# EAGLE board INV_H (EAGLE 9.6.2), part 1 of 2
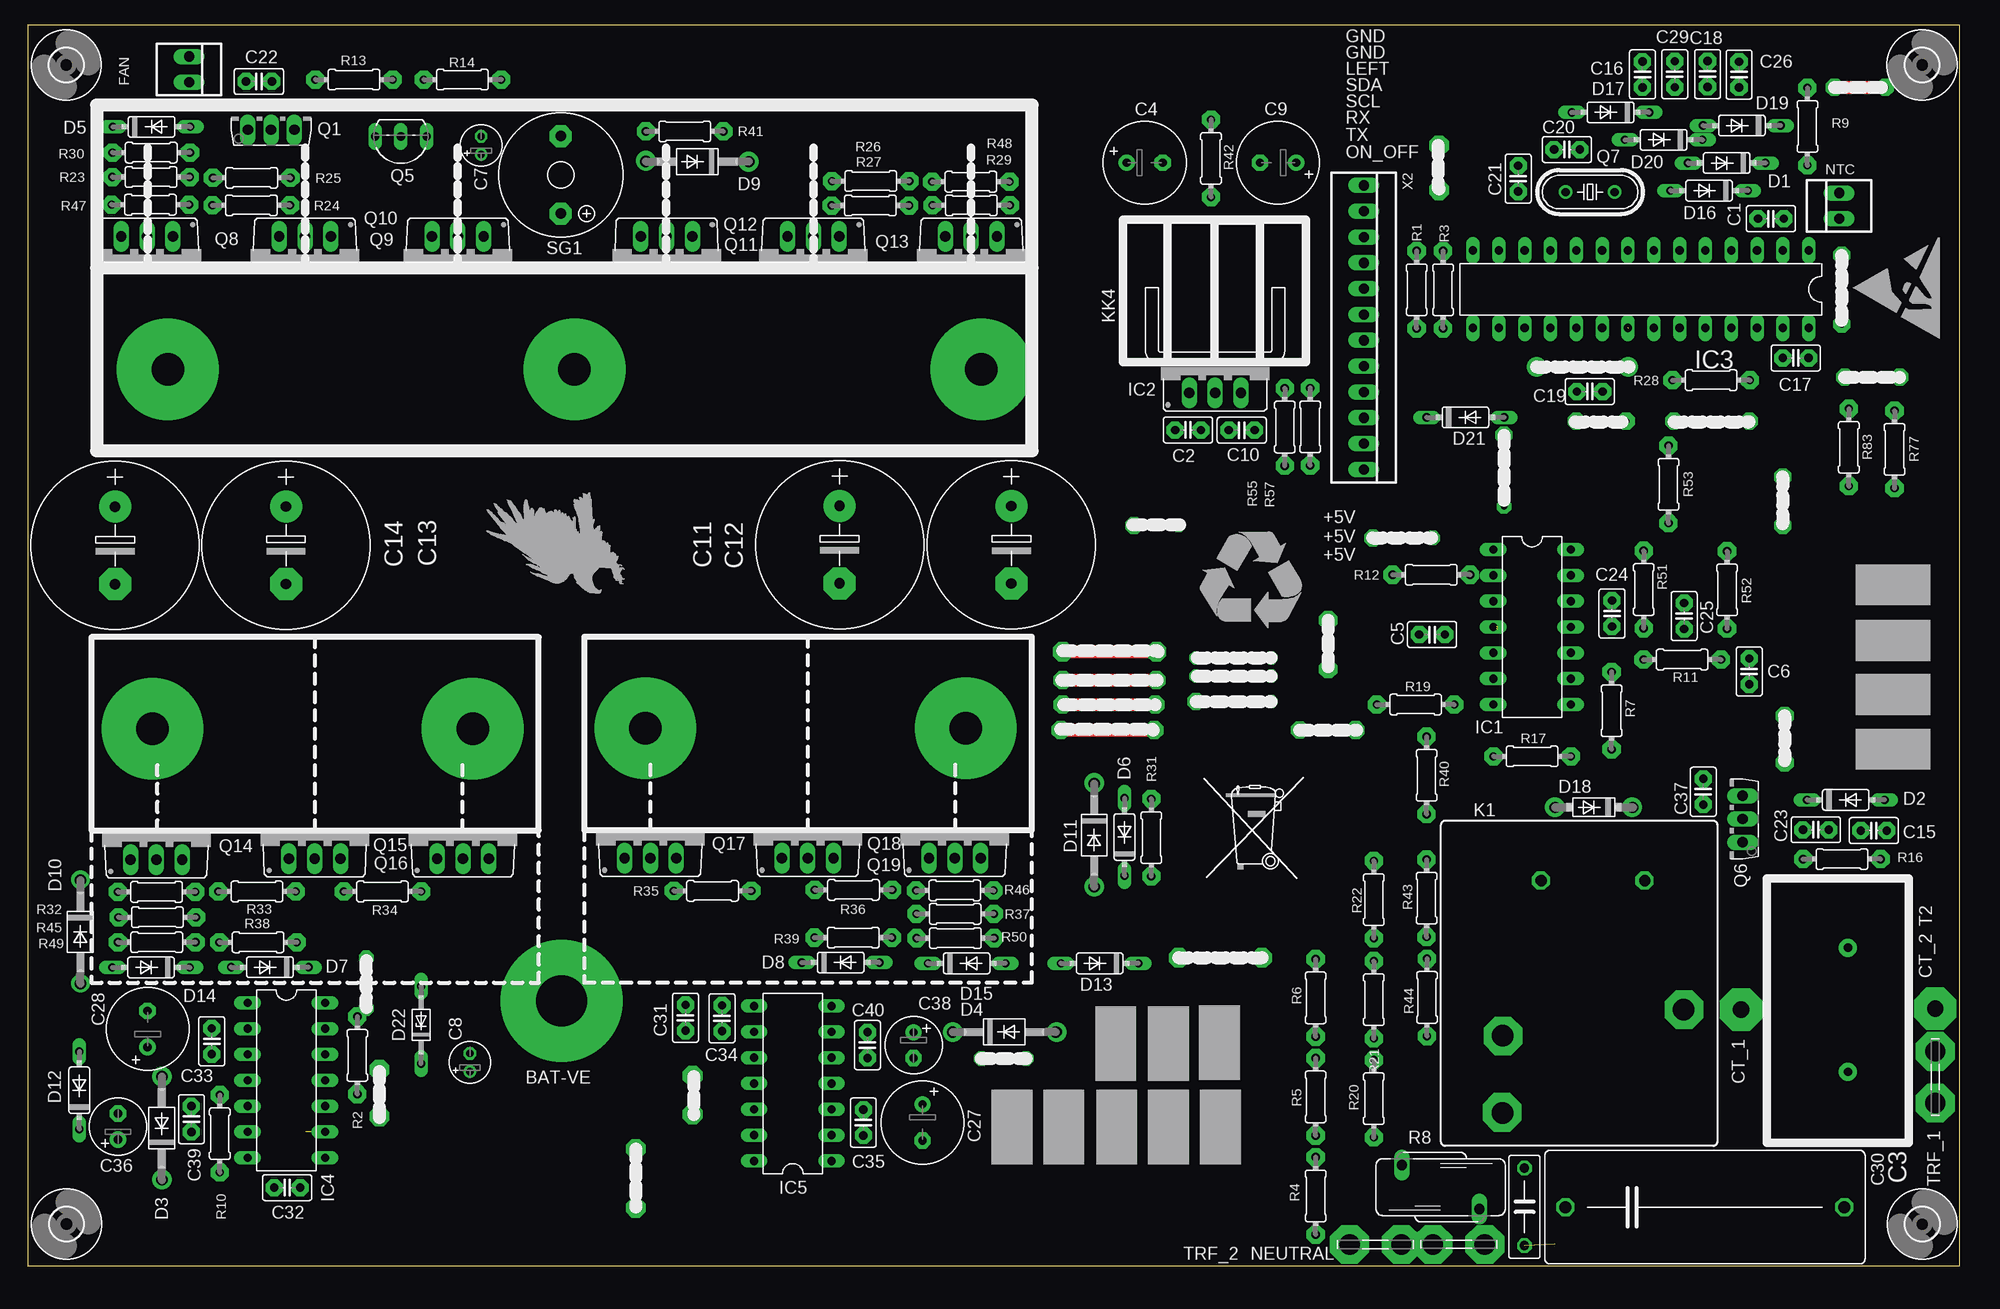
[diagram p1: board, top side]
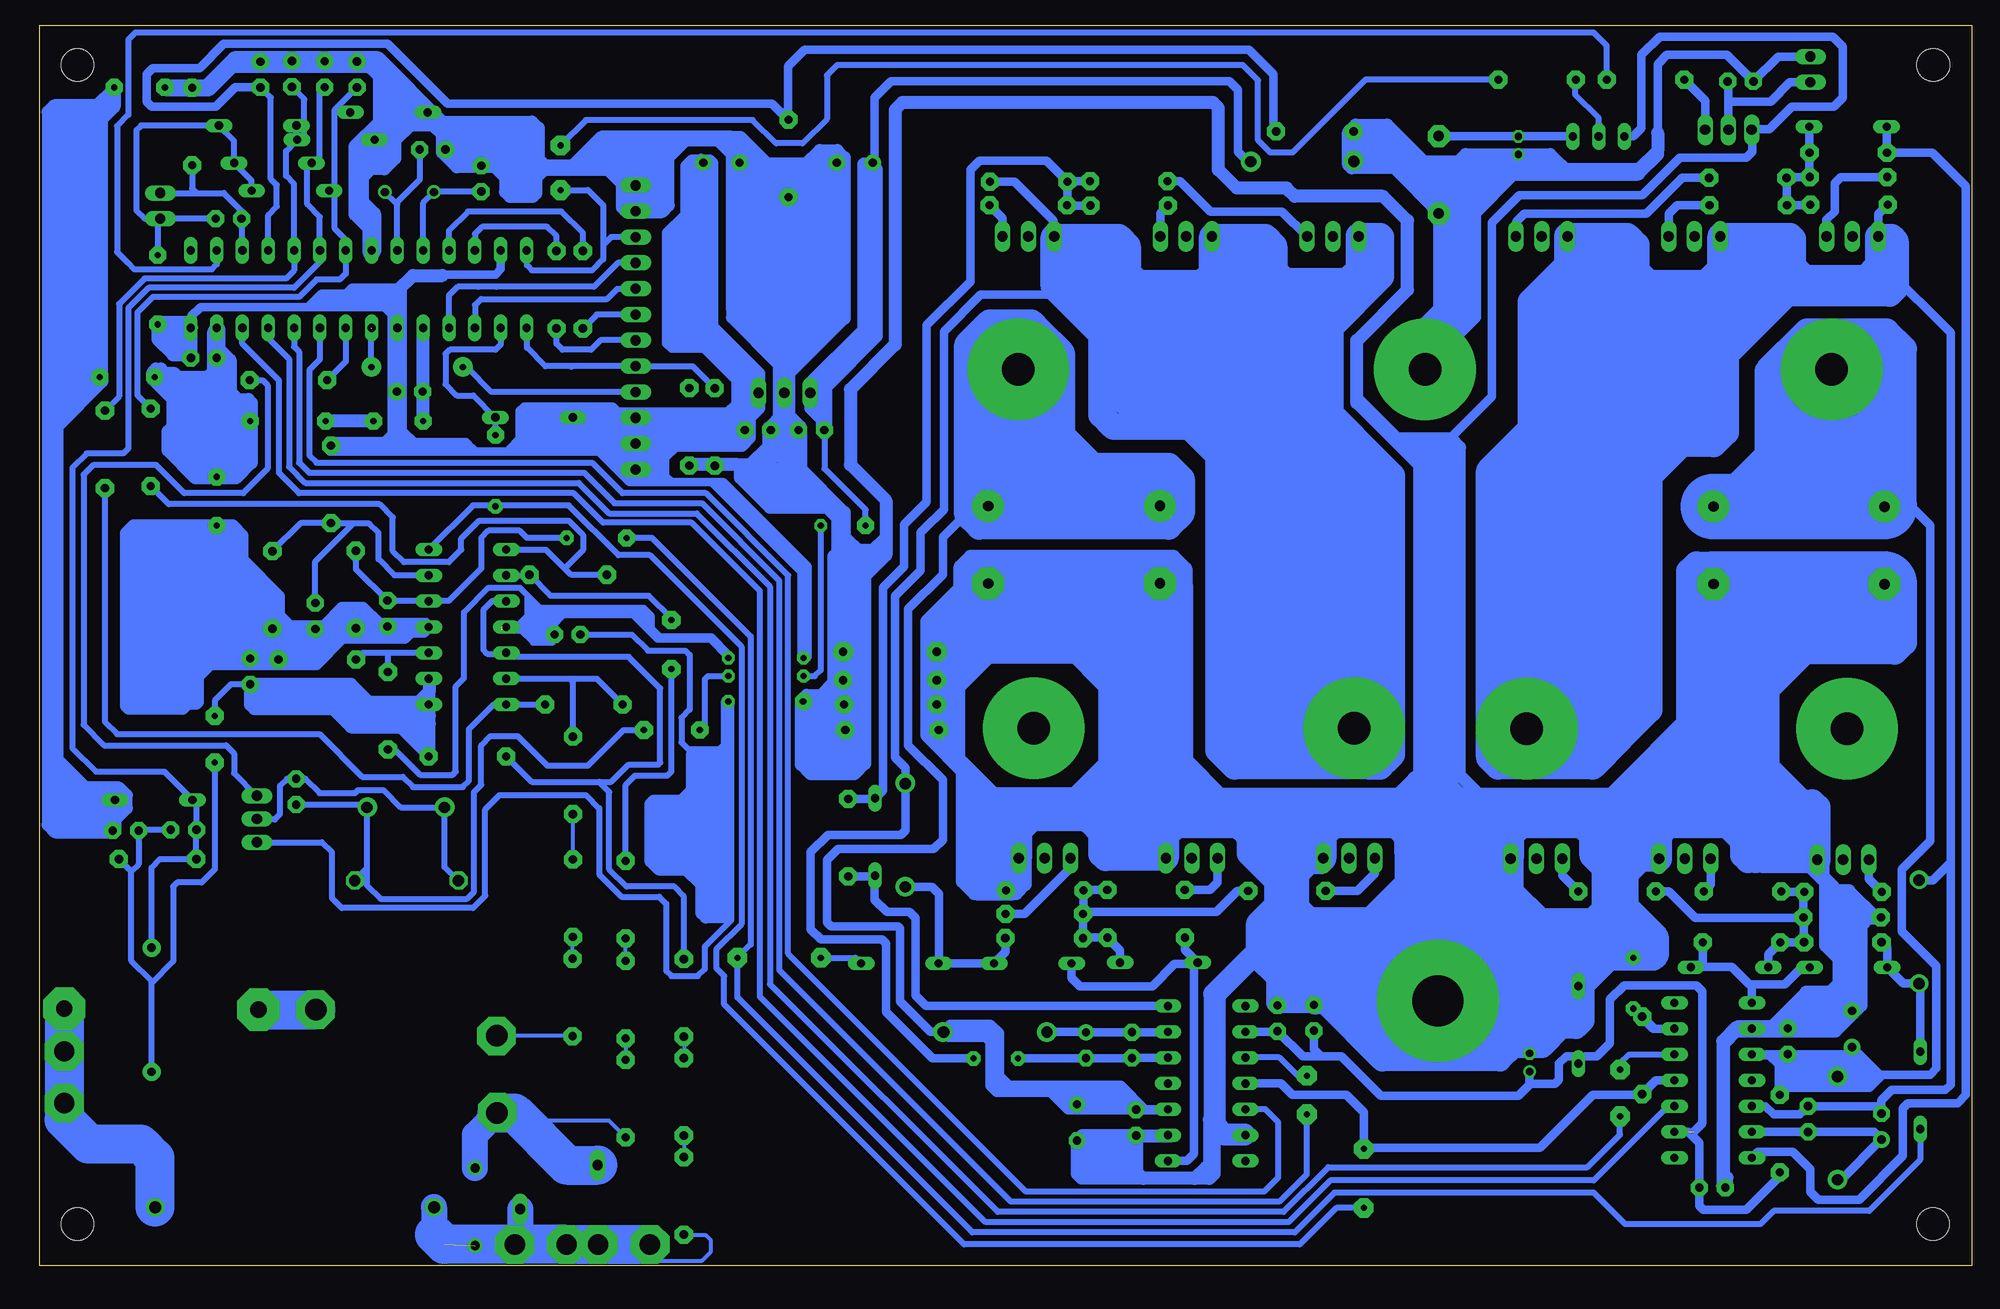
[diagram p2: board, bottom side, seen from below]

Size 190 x 122 mm. Coordinates in mm from the lower left corner, seen from the top.
Outline: 0,0 190,0 190,122 0,122 0,0
Copper layers (1*16): Top 0.035mm / dielectric 1.5mm / Bottom 0.035mm
Design rules "default": minimum track width 10mil, minimum drill 24mil, track to track 8mil, track to pad 8mil, pad to pad 8mil, via to via 8mil, smd to smd 8mil, copper to edge 40mil, drill to drill 8mil, minimum pad ring 10mil, minimum via ring 8mil, stop-mask expansion 4mil, vias tented up to drill 0mil, thermal gap 10mil

## Footprints (pad centres in the part's own frame; a part is rotated, then mirrored left to right if it is on the bottom)
8/5 = drill 5 pad 12: P$1 0,0
C025-025X050 = drill 0.813 octagon: 1 -1.27,0; 2 1.27,0 | drill 0.8 pad 1.676 octagon: 3 -1.27,0; 4 1.27,0
C275-113X316 = drill 1.194 octagon: 1 -13.716,0; 2 13.716,0
E3,5-8 = drill 0.813 pad 1.6: + -1.778,0 | drill 0.813 pad 1.6 octagon: - 1.778,0
E1,8-4 = drill 0.711 pad 1.168: + -0.889,0 | drill 0.711 pad 1.168 octagon: - 0.889,0
E7,5-16 = drill 1.016 pad 3.15: + -3.81,0 | drill 1.016 pad 3.15 octagon: - 3.81,0
C075-032X103 = drill 0.914 octagon: 1 -3.81,0; 2 3.81,0
E2,5-6 = drill 0.813 pad 1.6: + -1.27,0 | drill 0.813 pad 1.6 octagon: - 1.27,0
4,16O1,6 = drill 1.6 pad 4.166 octagon: 1 0,0
DO35-7 = drill 0.813 long: A 3.81,0; C -3.81,0
DO41-10 = drill 1.118: A 5.08,0; C -5.08,0
DO41-7.6 = drill 1.1 pad 1.7: A 3.81,0; C -3.81,0
DO34Z7 = drill 0.813 long: A 3.81,0; C -3.81,0
22-23-2021 = drill 1 long: 1 -1.27,0; 2 1.27,0
3,2 = hole 3.2: 0,0
DIL14 = drill 0.813 long: 1 -7.62,-3.81; 2 -5.08,-3.81; 3 -2.54,-3.81; 4 0,-3.81; 5 2.54,-3.81; 6 5.08,-3.81; 7 7.62,-3.81; 8 7.62,3.81; 9 5.08,3.81; 10 2.54,3.81; 11 0,3.81; 12 -2.54,3.81; 13 -5.08,3.81; 14 -7.62,3.81
78XXS = drill 1.016 long: GND 0,-2.54; IN -2.54,-2.54; OUT 2.54,-2.54
DIL28-3 = drill 0.813 long: 1 -16.51,-3.81; 2 -13.97,-3.81; 3 -11.43,-3.81; 4 -8.89,-3.81; 5 -6.35,-3.81; 6 -3.81,-3.81; 7 -1.27,-3.81; 8 1.27,-3.81; 9 3.81,-3.81; 10 6.35,-3.81; 11 8.89,-3.81; 12 11.43,-3.81; 13 13.97,-3.81; 14 16.51,-3.81; 15 16.51,3.81; 16 13.97,3.81; 17 11.43,3.81; 18 8.89,3.81; 19 6.35,3.81; 20 3.81,3.81; 21 1.27,3.81; 22 -1.27,3.81; 23 -3.81,3.81; 24 -6.35,3.81; 25 -8.89,3.81; 26 -11.43,3.81; 27 -13.97,3.81; 28 -16.51,3.81
JT-TMB = drill 1.1: 1 5.08,0; 2 -5.08,0 | drill 2.1: C -8.89,12.7; NC 8.89,22.86; NO 8.89,15.24
800W_BIG = drill 3.2 pad 10: P$1 7,8; P$2 47,8; P$3 87,8
TE_62409-1 = drill 1.43: 1 -2.54,0; 2 2.54,0
TO126AV = drill 1.016 long: B 2.286,-1.27; C 0,-1.27; E -2.286,-1.27
TO92-EBC = drill 0.813 long: B 0,-1.27; C -2.54,-1.27; E 2.54,-1.27
HC49/S = drill 0.813: 1 -2.413,0; 2 2.413,0
TO220BV = drill 1.016 long: D 0,-2.54; G -2.54,-2.54; S 2.54,-2.54
0204/7 = drill 0.8 pad 1.778 octagon: 1 -3.81,0; 2 3.81,0 | drill 0.813 octagon: 3 -3.81,0; 4 3.81,0
S10K385 = drill 1.016 long: 1 -2.159,-3.81; 2 2.159,3.81
F/TMB = drill 1.016 pad 2.159 octagon: + 3.81,0; - -3.81,0
CT_5A = drill 0.8 pad 1.778: P$1 0,0; P$2 12.2,0
800W_SMALL = drill 3 pad 6: P$1 6,10; P$2 37.5,10 | drill 3.2 pad 10: P$3 6,10; P$4 37.5,10
22-23-2121 = drill 1 long: 1 -13.97,0; 2 -11.43,0; 3 -8.89,0; 4 -6.35,0; 5 -3.81,0; 6 -1.27,0; 7 1.27,0; 8 3.81,0; 9 6.35,0; 10 8.89,0; 11 11.43,0; 12 13.97,0

## Placement (x,y rotation side)
BAT-VE  12/5  [8/5]  52.5,26.06 180 top
C1  0.1uF 50V  [C025-025X050]  171.44,102.99 0 top
C2  0.1uF 50V  [C025-025X050]  114.12,82.21 180 top
C3  1.5uF 305VAC  [C275-113X316]  164.95,5.77 0 top
C4  470uF 25V  [E3,5-8]  109.86,108.51 0 top
C5  0.1uF 50V  [C025-025X050]  138.12,62.09 0 top
C6  0.1uF 50V  [C025-025X050]  169.31,58.46 90 top
C7  1uF 16V  [E1,8-4]  44.6,110.2 90 top
C8  1uF 16V  [E1,8-4]  43.5,20 90 top
C9  470uF 25V  [E3,5-8]  122.97,108.49 180 top
C10  0.1uF 50V  [C025-025X050]  119.4,82.19 0 top
C11  2200uF 50V  [E7,5-16]  79.85,70.93 270 top
C12  2200uF 50V  [E7,5-16]  96.75,70.92 270 top
C13  2200uF 50V  [E7,5-16]  25.41,70.87 270 top
C14  2200uF 50V  [E7,5-16]  8.61,70.86 270 top
C15  0.1uF 50V  [C025-025X050]  181.56,42.81 180 top
C16  0.01uF 50V  [C025-025X050]  158.81,117.18 90 top
C17  0.1uF 50V  [C025-025X050]  173.88,89.29 0 top
C18  0.01uF 50V  [C025-025X050]  165.21,117.22 90 top
C19  0.1uF 50V  [C025-025X050]  153.62,85.99 0 top
C20  18pF 50V  [C025-025X050]  151.38,109.79 180 top
C21  18pF 50V  [C025-025X050]  146.59,106.93 90 top
C22  0.1uF 50V  [C025-025X050]  22.75,116.49 180 top
C23  0.01uF 50V  [C025-025X050]  175.86,42.89 0 top
C24  18pF 50V  [C025-025X050]  155.81,64.16 270 top
C25  0.1uF 50V  [C025-025X050]  162.91,63.91 270 top
C26  0.1uF 50V  [C025-025X050]  168.31,117.17 270 top
C27  470uF 25V  [E3,5-8]  88,14.1 270 top
C28  470uF 25V  [E3,5-8]  11.8,23.3 90 top
C29  0.01uF 50V  [C025-025X050]  161.99,117.2 270 top
C30  103 2KV  [C075-032X103]  147.2,5.8 270 top
C31  0.1uF 50V  [C025-025X050]  64.7,24.4 270 top
C32  0.1uF 50V  [C025-025X050]  25.53,7.69 180 top
C33  0.1uF 50V  [C025-025X050]  18.11,22.09 270 top
C34  0.1uF 50V  [C025-025X050]  68.29,24.35 90 top
C35  0.1uF 50V  [C025-025X050]  82.19,14.09 90 top
C36  100uF 25V  [E2,5-6]  8.89,13.7 90 top
C37  0.1uF 50V  [C025-025X050]  164.79,46.63 90 top
C38  100uF 25V  [E2,5-6]  87.13,21.7 270 top
C39  0.1uF 50V  [C025-025X050]  16.11,14.43 270 top
C40  0.1uF 50V  [C025-025X050]  82.59,21.71 90 top
CT_1  WIREPAD4,16O1,6  [4,16O1,6]  168.5,25.2 0 top
CT_2  WIREPAD4,16O1,6  [4,16O1,6]  187.6,25.3 0 top
D1  1N4148DO35-7  [DO35-7]  167.09,108.47 180 top
D2  1N4148DO35-7  [DO35-7]  178.8,45.83 0 top
D3  UF4007  [DO41-10]  13.2,13.54 90 top
D4  UF4007  [DO41-10]  96.04,23 0 top
D5  1N4148DO35-7  [DO35-7]  12.19,112.03 0 top
D6  1N4148DO35-7  [DO35-7]  107.87,42.18 90 top
D7  1N4148DO35-7  [DO35-7]  23.83,29.37 180 top
D8  1N4148DO35-7  [DO35-7]  79.96,29.83 0 top
D9  1N4007  [DO41-10]  65.86,108.6 180 top
D10  1N4007  [DO41-10]  5.19,32.85 270 top
D11  1N4007  [DO41-10]  104.89,42.35 270 top
D12  1N4148DO35-7  [DO35-7]  5.09,17.27 90 top
D13  1N4148DO35-7  [DO35-7]  105.43,29.75 180 top
D14  1N4148DO35-7  [DO35-7]  12.14,29.35 180 top
D15  1N4148DO35-7  [DO35-7]  92.35,29.75 0 top
D16  1N4148DO35-7  [DO35-7]  165.36,105.75 180 top
D17  1N4148DO35-7  [DO35-7]  155.67,113.45 180 top
D18  1N5819-T  [DO41-7.6]  154.03,45.1 180 top
D19  1N4148DO35-7  [DO35-7]  168.58,112.15 180 top
D20  1N4148DO35-7  [DO35-7]  160.89,110.75 180 top
D21  1N4148DO35-7  [DO35-7]  141.4,83.45 0 top
D22  5V1  [DO34Z7]  38.7,23.7 90 top
FAN  22-23-2021  [22-23-2021]  15.88,117.67 270 top
H1  MOUNT-HOLE3.2  [3,2]  3.8,118.11 0 top
H3  MOUNT-HOLE3.2  [3,2]  186.31,118.11 0 top
H5  MOUNT-HOLE3.2  [3,2]  3.82,4.11 0 top
H6  MOUNT-HOLE3.2  [3,2]  186.32,4.1 0 top
IC1  LM324N  [DIL14]  147.95,62.83 270 top
IC2  7805  [78XXS]  116.78,88.39 0 top
IC3  DSPIC30F2010/SPG  [DIL28-3]  158.65,96.05 180 top
IC4  IR2110D  [DIL14]  25.45,18.25 270 top
IC5  IR2110D  [DIL14]  75.25,17.93 90 top
K1  JTN-TMB-DC12V  [JT-TMB]  153.96,37.89 180 top
KK4  D03S  [D03S]  116.78,89.86 0 top
KK5  HS_800_BIG  [800W_BIG]  6.79,80.17 0 top
NEUTRAL  62409-1  [TE_62409-1]  132.54,2.09 180 top
NTC  22-23-2021  [22-23-2021]  178.15,104.25 90 top
Q1  BD139  [TO126AV]  23.94,113.01 0 top
Q5  BC546  [TO92-EBC]  36.71,109.82 180 top
Q6  BD139  [TO126AV]  167.39,43.95 90 top
Q7  8MHZ  [HC49/S]  153.66,105.61 0 top
Q8  IRF540  [TO220BV]  11.75,98.71 180 top
Q9  IRF540  [TO220BV]  27.28,98.71 180 top
Q10  IRF540  [TO220BV]  42.31,98.71 180 top
Q11  IRF540  [TO220BV]  62.84,98.71 180 top
Q12  IRF540  [TO220BV]  77.27,98.71 180 top
Q13  IRF540  [TO220BV]  92.8,98.71 180 top
Q14  IRF540  [TO220BV]  12.67,42.49 0 top
Q15  IRF540  [TO220BV]  28.24,42.59 0 top
Q16  IRF540  [TO220BV]  42.81,42.59 0 top
Q17  IRF540  [TO220BV]  61.25,42.62 0 top
Q18  IRF540  [TO220BV]  76.72,42.62 0 top
Q19  IRF540  [TO220BV]  91.19,42.62 0 top
R1  1K  [0204/7]  136.6,96 270 top
R2  4K7  [0204/7]  32.43,20.7 270 top
R3  1K  [0204/7]  139.2,96 270 top
R4  820K  [0204/7]  126.67,6.88 90 top
R5  820K  [0204/7]  126.67,16.62 90 top
R6  820K  [0204/7]  126.67,26.36 90 top
R7  10K  [0204/7]  155.77,54.6 90 top
R8  S10K385  [S10K385]  138.96,7.74 90 top
R9  4.7K  [0204/7]  175.03,112.06 270 top
R10  1K  [0204/7]  18.9,13 90 top
R11  10K  [0204/7]  162.72,59.63 0 top
R12  10K  [0204/7]  138.04,67.97 180 top
R13  4.7K  [0204/7]  32.1,116.67 180 top
R14  4.7K  [0204/7]  42.76,116.67 180 top
R16  220R  [0204/7]  178.42,40.01 0 top
R17  10K  [0204/7]  147.96,50.11 0 top
R19  10K  [0204/7]  136.5,55.21 0 top
R20  820K  [0204/7]  132.39,16.44 90 top
R21  820K  [0204/7]  132.39,26.18 90 top
R22  820K  [0204/7]  132.39,36.02 90 top
R23  4.7R  [0204/7]  12.14,107.09 180 top
R24  4.7R  [0204/7]  22,104.31 0 top
R25  4.7R  [0204/7]  22.04,107.01 0 top
R26  4.7R  [0204/7]  82.92,106.69 180 top
R27  4.7R  [0204/7]  82.88,104.29 180 top
R28  4.7K  [0204/7]  165.56,87.11 0 top
R29  4.7R  [0204/7]  92.8,104.31 0 top
R30  4.7R  [0204/7]  12.16,109.49 180 top
R31  4.7R  [0204/7]  110.51,42.12 270 top
R32  4.7R  [0204/7]  12.68,36.78 180 top
R33  4.7R  [0204/7]  22.56,36.82 0 top
R34  4.7R  [0204/7]  34.9,36.82 0 top
R35  4.7R  [0204/7]  67.36,36.88 180 top
R36  4.7R  [0204/7]  81.22,36.98 180 top
R37  4.7R  [0204/7]  91.22,34.62 0 top
R38  4.7R  [0204/7]  22.66,31.82 0 top
R39  4.7R  [0204/7]  81.2,32.28 180 top
R40  820K  [0204/7]  137.58,48.24 90 top
R41  47K 1%  [0204/7]  64.62,111.58 180 top
R42  10K 1%  [0204/7]  116.38,108.92 90 top
R43  820K  [0204/7]  137.58,36.16 90 top
R44  820K  [0204/7]  137.62,26.4 270 top
R45  10K  [0204/7]  12.76,34.28 180 top
R46  10K  [0204/7]  91.18,36.92 0 top
R47  10K  [0204/7]  12.08,104.37 180 top
R48  10K  [0204/7]  92.76,106.63 0 top
R49  10K  [0204/7]  12.7,31.83 0 top
R50  10K  [0204/7]  91.24,32.23 0 top
R51  10K  [0204/7]  158.93,66.52 270 top
R52  470R  [0204/7]  167.13,66.48 270 top
R53  4K7  [0204/7]  161.37,76.86 90 top
R55  4.7K  [0204/7]  123.63,82.5 270 top
R57  4.7K  [0204/7]  126.13,82.52 270 top
R77  1K5  [0204/7]  183.6,80.3 270 top
R83  1K5  [0204/7]  179.1,80.5 270 top
SG1  F/TMB  [F/TMB]  52.44,107.31 270 top
T2  CT_5A  [CT_5A]  179.02,19.09 90 top
TRF_1  62409-1  [TE_62409-1]  187.61,18.56 270 top
TRF_2  62409-1  [TE_62409-1]  140.75,2.11 0 top
U$1  HS_800_SMALL  [800W_SMALL]  6.27,42.84 0 top
U$2  HS_800_SMALL  [800W_SMALL]  54.75,42.87 0 top
U$3  [ESD_10.00]  188.1,91.1 90 top
U$4  [MUELLTONNE_10.00]  115,37.7 0 top
U$5  [RECYCLING_10.00]  115.2,62.5 0 top
U$6  [EAGLE-PLC-10MM]  58.7,66.1 90 top
X2  22-23-2121  [22-23-2121]  131.4,92.3 270 top